# EAGLE design B (EAGLE 9.6.2)
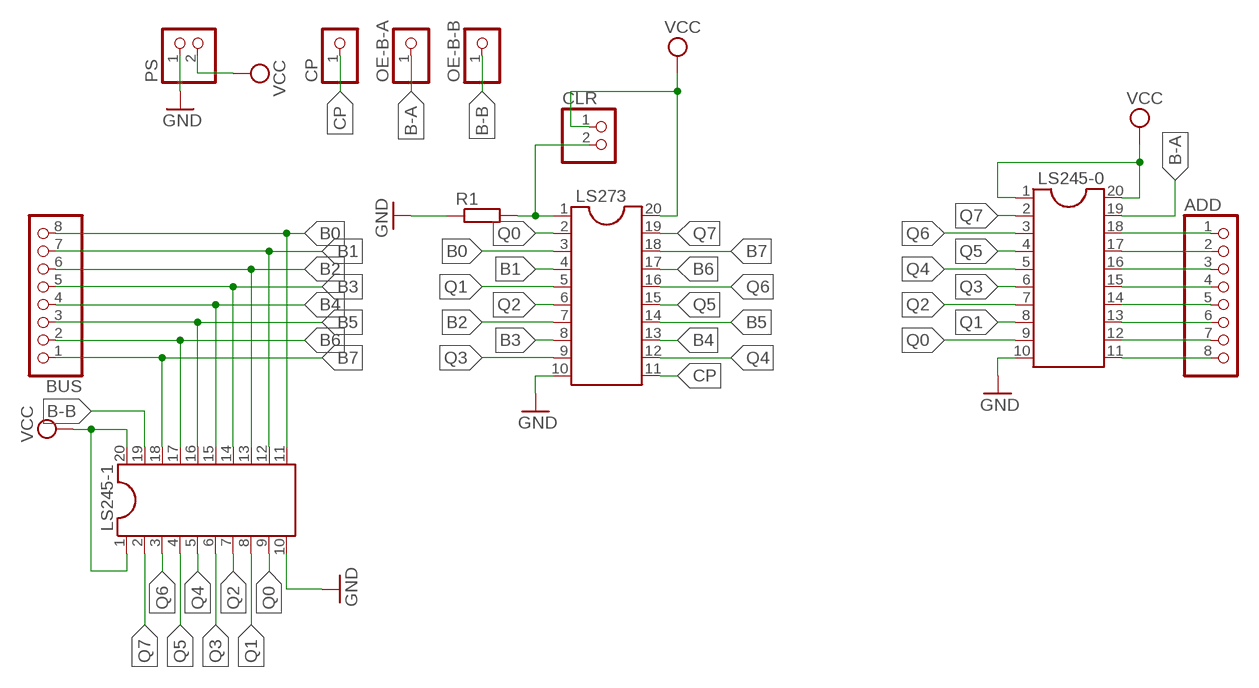
[diagram p0: schematic, sheet 1]

## Parts
ADD  PINHD-1X8  [1X08]
BUS  PINHD-1X8  [1X08]
CLR  PINHD-1X2  [1X02]
CP  PINHD-1X1  [1X01]
LS245-0  DIL20S  [SOCKET-20]
LS245-1  DIL20S  [SOCKET-20]
LS273  DIL20S  [SOCKET-20]
OE-B-A  PINHD-1X1  [1X01]
OE-B-B  PINHD-1X1  [1X01]
PS  PINHD-1X2  [1X02]
R1  R-EU_0204/7  [0204/7]

## Nets
A0: ADD.1 LS245-0.18
A1: ADD.2 LS245-0.17
A2: ADD.3 LS245-0.16
A3: ADD.4 LS245-0.15
A4: ADD.5 LS245-0.14
A5: ADD.6 LS245-0.13
A6: ADD.7 LS245-0.12
A7: ADD.8 LS245-0.11
B0: BUS.8 LS245-1.11 LS273.3
B1: BUS.7 LS245-1.12 LS273.4
B2: BUS.6 LS245-1.13 LS273.7
B3: BUS.5 LS245-1.14 LS273.8
B4: BUS.4 LS245-1.15 LS273.13
B5: BUS.3 LS245-1.16 LS273.14
B6: BUS.2 LS245-1.17 LS273.17
B7: BUS.1 LS245-1.18 LS273.18
B-A: LS245-0.19 OE-B-A.1
B-B: LS245-1.19 OE-B-B.1
CLR: CLR.2 LS273.1 R1.2
CP: CP.1 LS273.11
GND: LS245-0.10 LS245-1.10 LS273.10 PS.1 R1.1
Q0: LS245-0.9 LS245-1.9 LS273.2
Q1: LS245-0.8 LS245-1.8 LS273.5
Q2: LS245-0.7 LS245-1.7 LS273.6
Q3: LS245-0.6 LS245-1.6 LS273.9
Q4: LS245-0.5 LS245-1.5 LS273.12
Q5: LS245-0.4 LS245-1.4 LS273.15
Q6: LS245-0.3 LS245-1.3 LS273.16
Q7: LS245-0.2 LS245-1.2 LS273.19
VCC: CLR.1 LS245-0.1 LS245-0.20 LS245-1.1 LS245-1.20 LS273.20 PS.2

## Library data of the parts
ADD BUS = pinhead:PINHD-1X8: PIN HEADER
CLR PS = pinhead:PINHD-1X2: PIN HEADER
CP OE-B-A OE-B-B = pinhead:PINHD-1X1: PIN HEADER
LS245-0 LS245-1 LS273 = ic-package:DIL20: Dual In Line / Socket
R1 = rcl:R-EU_: RESISTOR, European symbol; SPICEPREFIX: R

## Board
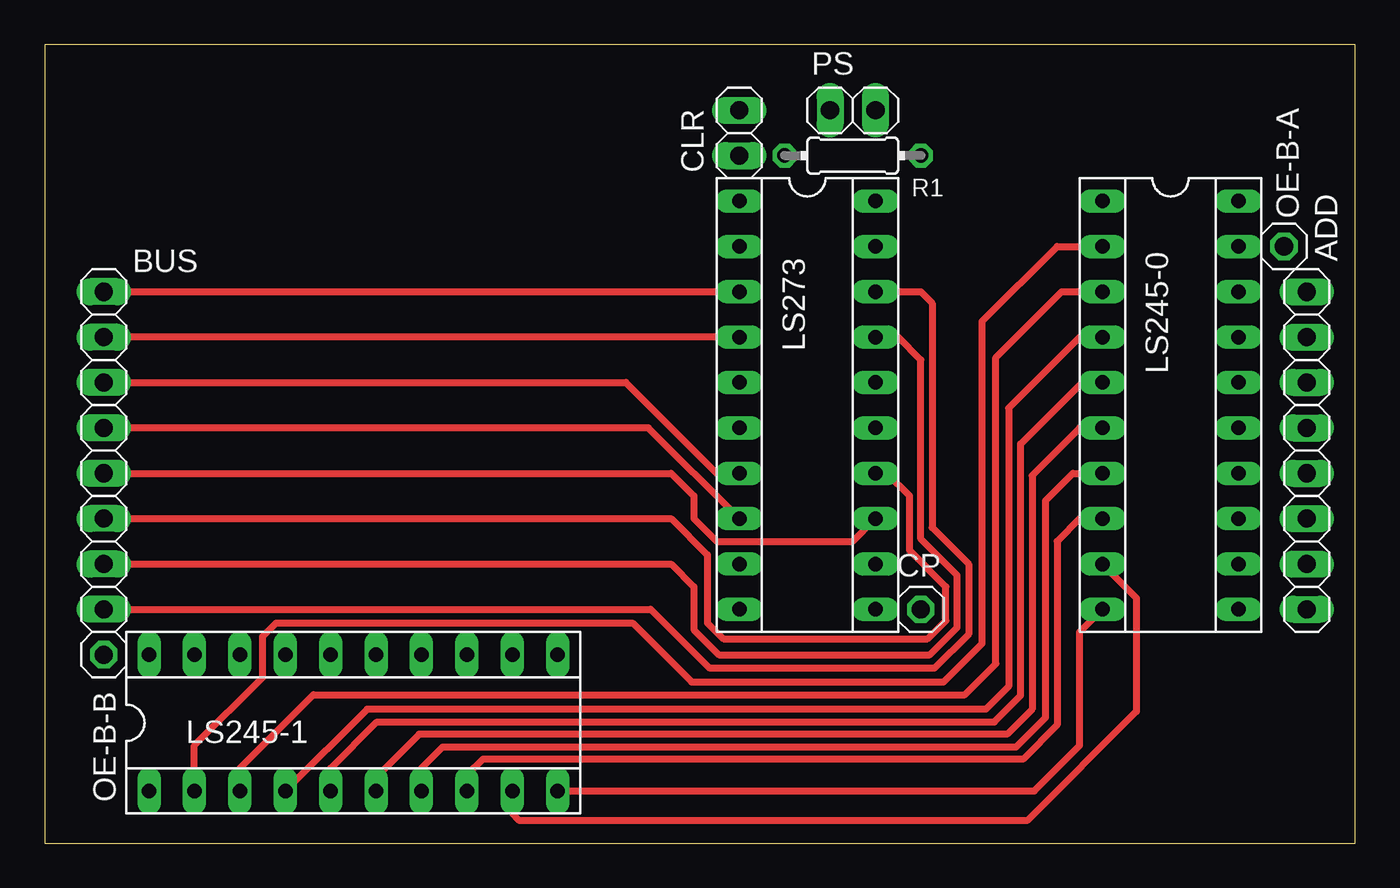
[diagram p1: board, top side]
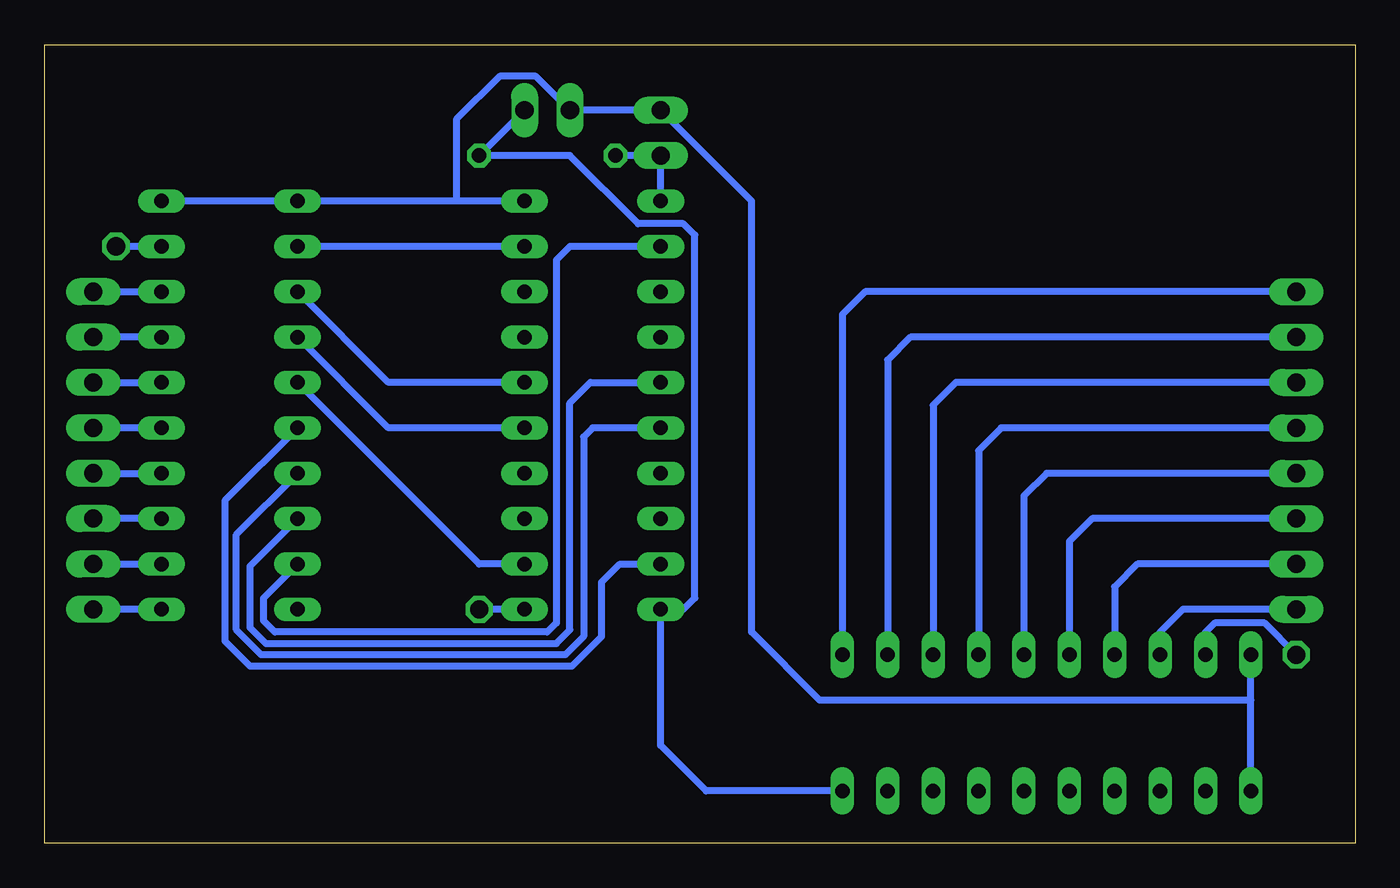
[diagram p2: board, bottom side, seen from below]

Size 73.33 x 44.69 mm. Coordinates in mm from the lower left corner, seen from the top.
Outline: 0,0 73.33,0 73.33,44.69 0,44.69 0,0
Copper layers (1*16): Top 0.035mm / dielectric 1.5mm / Bottom 0.035mm
Design rules "default": minimum track width 6mil, minimum drill 0.35mm, track to track 6mil, track to pad 6mil, pad to pad 6mil, via to via 6mil, smd to smd 6mil, copper to edge 40mil, drill to drill 6mil, minimum pad ring 10mil, minimum via ring 8mil, stop-mask expansion 4mil, vias tented up to drill 0mil, thermal gap 10mil

### Footprints (pad centres in the part's own frame; a part is rotated, then mirrored left to right if it is on the bottom)
1X08 = drill 1.016 long: 1 -8.89,0; 2 -6.35,0; 3 -3.81,0; 4 -1.27,0; 5 1.27,0; 6 3.81,0; 7 6.35,0; 8 8.89,0
1X02 = drill 1.016 long: 1 -1.27,0; 2 1.27,0
1X01 = drill 1.016 octagon: 1 0,0
SOCKET-20 = drill 0.813 long: 1 -11.43,-3.81; 2 -8.89,-3.81; 3 -6.35,-3.81; 4 -3.81,-3.81; 5 -1.27,-3.81; 6 1.27,-3.81; 7 3.81,-3.81; 8 6.35,-3.81; 9 8.89,-3.81; 10 11.43,-3.81; 11 11.43,3.81; 12 8.89,3.81; 13 6.35,3.81; 14 3.81,3.81; 15 1.27,3.81; 16 -1.27,3.81; 17 -3.81,3.81; 18 -6.35,3.81; 19 -8.89,3.81; 20 -11.43,3.81
0204/7 = drill 0.813 octagon: 1 -3.81,0; 2 3.81,0

### Placement (x,y rotation side)
ADD  70.61,21.97 270 top
BUS  3.3,21.97 90 top
CLR  38.86,39.75 270 top
CP  49.02,13.08 0 top
LS245-0  62.99,24.51 270 top
LS245-1  17.27,6.73 0 top
LS273  42.67,24.51 270 top
OE-B-A  69.34,33.4 0 top
OE-B-B  3.3,10.54 0 top
PS  45.21,41.02 180 top
R1  45.21,38.48 180 top

### Tracks (layer width: path | path; a pad name or v marks a point on that pad's centre or on a via)
A0
  Bottom 0.4: ADD.1 LS245-0.18
A1
  Bottom 0.4: LS245-0.17 ADD.2
A2
  Bottom 0.4: ADD.3 LS245-0.16
A3
  Bottom 0.4: LS245-0.15 ADD.4
A4
  Bottom 0.4: ADD.5 LS245-0.14
A5
  Bottom 0.4: LS245-0.13 ADD.6
A6
  Bottom 0.4: ADD.7 LS245-0.12
A7
  Bottom 0.4: LS245-0.11 ADD.8
B0
  Top 0.4: BUS.8 LS273.3
  Bottom 0.4: BUS.8 27.43,30.86 28.7,29.59 LS245-1.11
B1
  Top 0.4: LS273.4 BUS.7
  Bottom 0.4: BUS.7 24.89,28.32 26.16,27.05 LS245-1.12
B2
  Top 0.4: BUS.6 32.51,25.78 37.59,20.7 LS273.7
  Bottom 0.4: BUS.6 22.35,25.78 23.62,24.51 LS245-1.13
B3
  Top 0.4: BUS.5 33.78,23.24 LS273.8
  Bottom 0.4: BUS.5 19.81,23.24 21.08,21.97 LS245-1.14
B4
  Top 0.4: BUS.4 35.05,20.7 36.32,19.43 36.32,18.16 37.59,16.89 45.21,16.89 LS273.13
  Bottom 0.4: BUS.4 17.27,20.7 18.54,19.43 LS245-1.15
B5
  Top 0.4: BUS.3 35.05,18.16 37.08,16.13 37.08,12.32 37.97,11.43 49.4,11.43 50.42,12.45 50.42,14.35 48.39,16.38 48.39,19.43 47.12,20.7 LS273.14
  Bottom 0.4: BUS.3 14.73,18.16 16,16.89 LS245-1.16
B6
  Top 0.4: BUS.2 35.05,15.62 36.32,14.35 36.32,11.94 37.72,10.54 49.53,10.54 51.05,12.06 51.05,14.99 49.02,17.02 49.02,27.05 47.75,28.32 LS273.17
  Bottom 0.4: BUS.2 12.19,15.62 13.46,14.35 LS245-1.17
B7
  Top 0.4: LS273.18 49.02,30.86 49.66,30.23 49.66,17.65 51.69,15.62 51.69,11.68 49.78,9.78 37.21,9.78 33.91,13.08 BUS.1
  Bottom 0.4: BUS.1 9.65,13.08 10.92,11.81 LS245-1.18
B-A
  Bottom 0.4: LS245-0.19 OE-B-A.1
B-B
  Bottom 0.4: LS245-1.19 8.38,11.81 7.87,12.32 5.08,12.32 OE-B-B.1
CLR
  Bottom 0.4: LS273.1 CLR.2 R1.2
CP
  Bottom 0.4: LS273.11 CP.1
GND
  Top 0.4: LS245-1.10 55.37,2.92 57.91,5.46 57.91,11.81 LS245-0.10
  Bottom 0.4: PS.1 R1.1 43.94,38.48 40.13,34.67 37.59,34.67 36.96,34.04 36.96,13.72 37.59,13.08 LS273.10 38.86,5.46 36.32,2.92 LS245-1.10
Q0
  Top 0.4: LS245-1.9 26.16,1.65 26.57,1.25 54.97,1.25 61.09,7.37 61.09,13.72 LS245-0.9
  Bottom 0.4: LS273.2 43.94,33.4 44.7,32.64 44.7,12.32 45.21,11.81 60.45,11.81 61.09,12.45 61.09,13.72 LS245-0.9
Q1
  Top 0.4: LS245-0.8 57.91,18.16 56.64,16.89 56.64,6.6 54.74,4.7 24.51,4.7 23.62,3.81 LS245-1.8
  Bottom 0.4: LS245-0.8 61.85,15.49 61.85,12.06 60.96,11.18 44.7,11.18 43.94,11.94 43.94,24.64 42.8,25.78 LS273.5
Q2
  Top 0.4: LS245-1.7 21.08,4.19 22.27,5.38 54.36,5.38 56.01,7.03 56.01,19.18 57.53,20.7 LS245-0.7
  Bottom 0.4: LS273.6 42.67,23.24 43.18,22.73 43.18,11.56 44.2,10.54 61.21,10.54 62.61,11.94 62.61,17.27 LS245-0.7
Q3
  Top 0.4: LS245-0.6 57.91,23.24 55.24,20.57 55.24,7.49 53.85,6.1 20.95,6.1 18.54,3.68 LS245-1.6
  Bottom 0.4: LS245-0.6 63.25,19.18 63.25,11.3 61.85,9.91 43.81,9.91 42.16,11.56 42.16,14.61 41.15,15.62 LS273.9
Q4
  Top 0.4: LS245-1.5 16,4.19 18.59,6.78 53.13,6.78 54.61,8.26 54.61,22.35 58.04,25.78 LS245-0.5
  Bottom 0.4: LS273.12 49.02,15.62 LS245-0.5
Q5
  Top 0.4: LS245-0.4 57.91,28.32 53.93,24.34 53.93,8.76 52.66,7.49 18.03,7.49 LS245-1.4
  Bottom 0.4: LS273.15 54.1,23.24 LS245-0.4
Q6
  Top 0.4: LS245-1.3 10.92,4.19 15.03,8.3 51.48,8.3 53.21,10.03 53.21,27.18 56.9,30.86 LS245-0.3
  Bottom 0.4: LS245-0.3 54.1,25.78 LS273.16
Q7
  Top 0.4: LS245-0.2 56.64,33.4 52.45,29.21 52.45,11.18 50.29,9.02 36.2,9.02 32.89,12.32 12.95,12.32 12.19,11.56 12.19,9.27 8.38,5.46 LS245-1.2
  Bottom 0.4: LS273.19 LS245-0.2
VCC
  Bottom 0.4: LS245-1.1 5.84,8 | 5.84,8 LS245-1.20 | LS273.20 50.29,35.94 | 50.29,35.94 LS245-0.1 LS245-0.20 | 50.29,35.94 50.29,40.51 47.88,42.93 45.85,42.93 PS.2 CLR.1 33.78,35.94 33.78,11.81 29.97,8 5.84,8